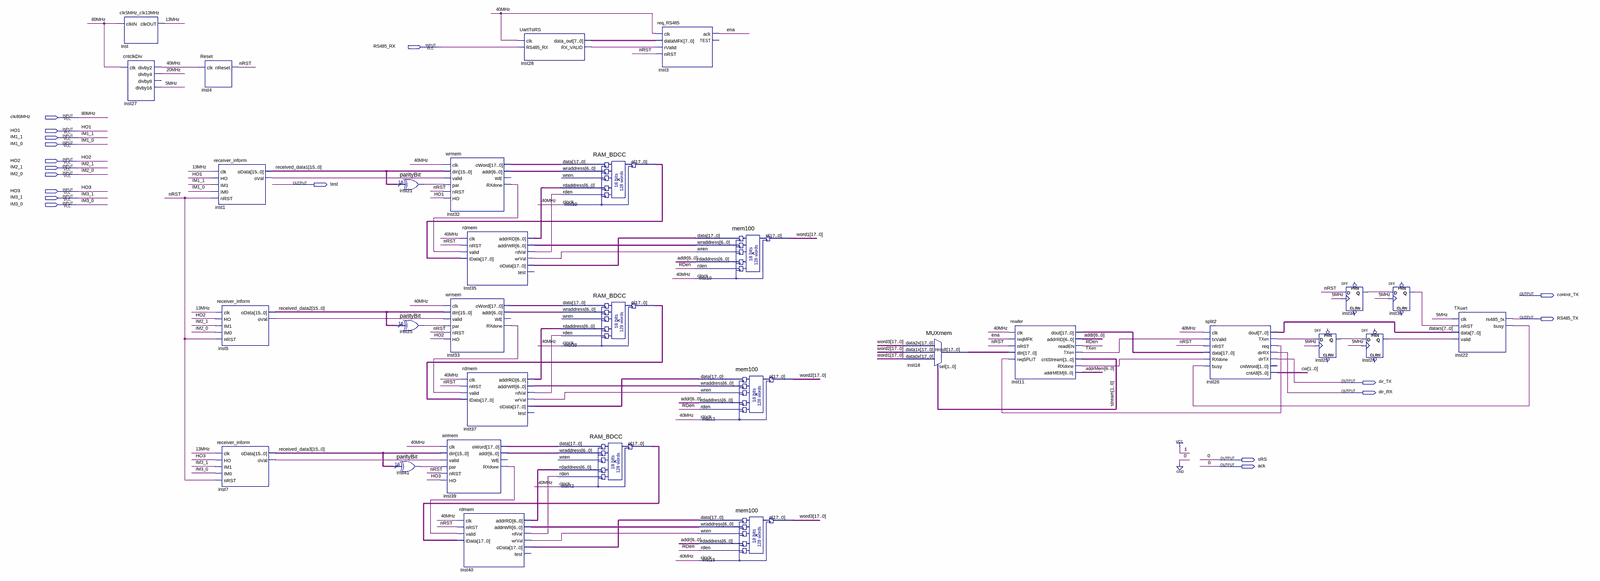
[diagram p0: schematic sheet, whole]
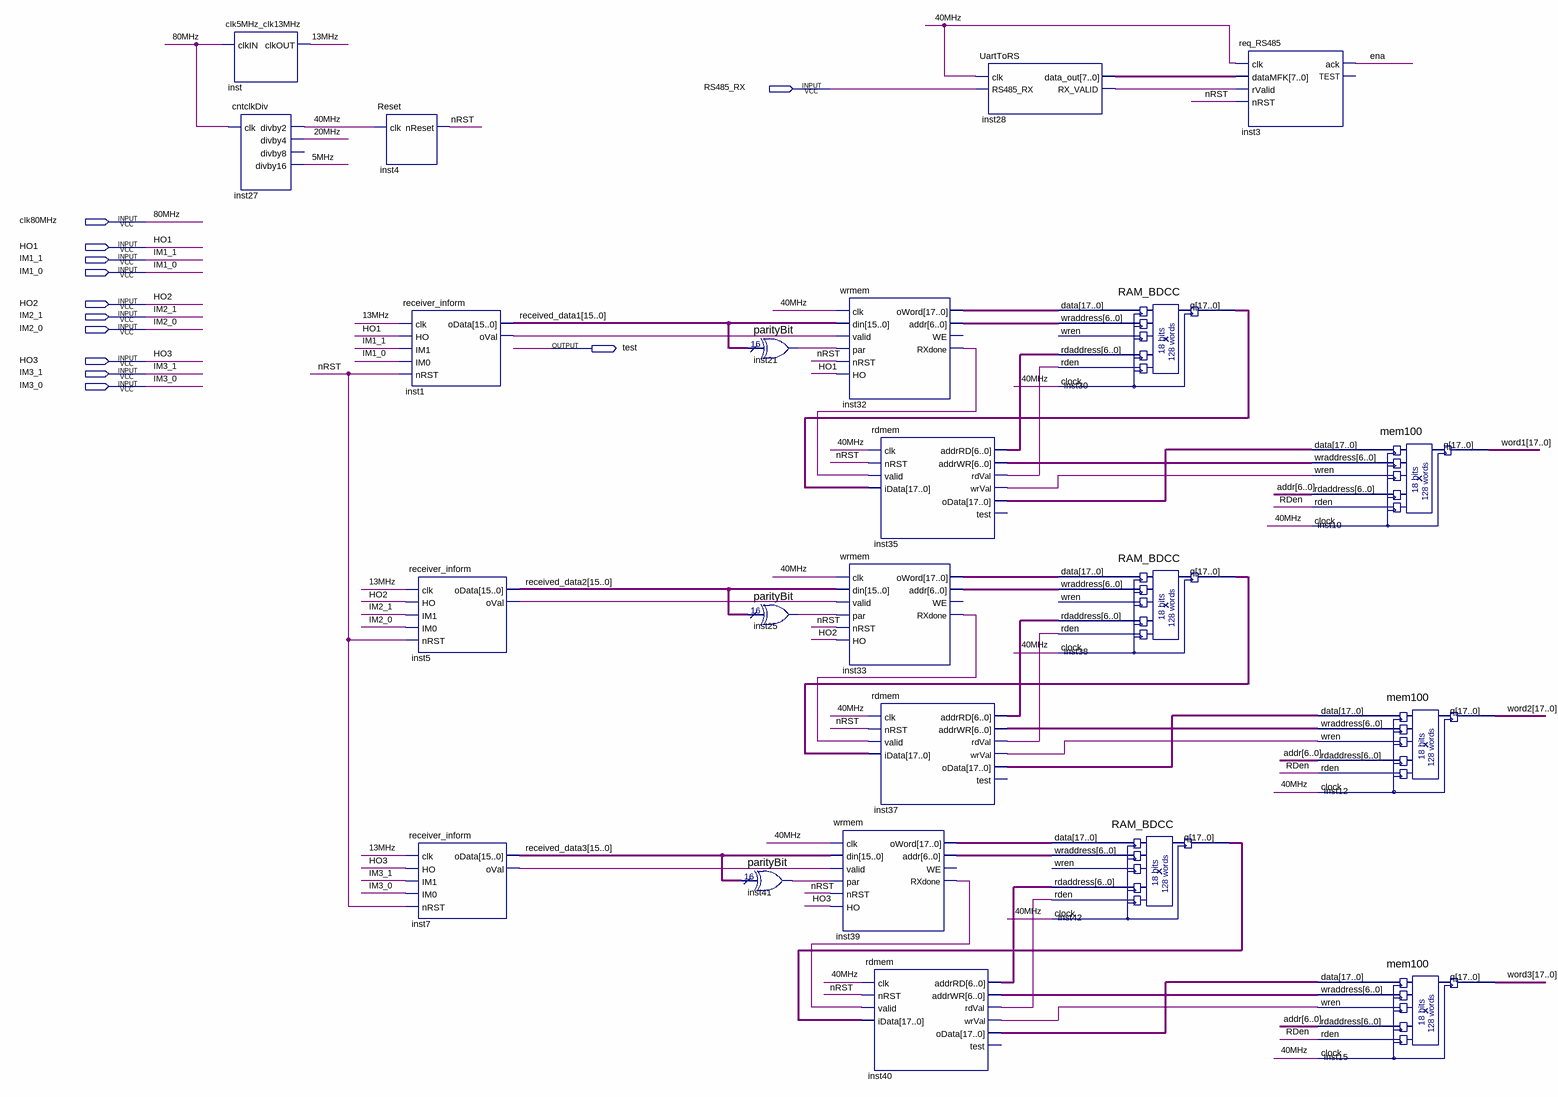
[diagram p1: schematic sheet, left part]
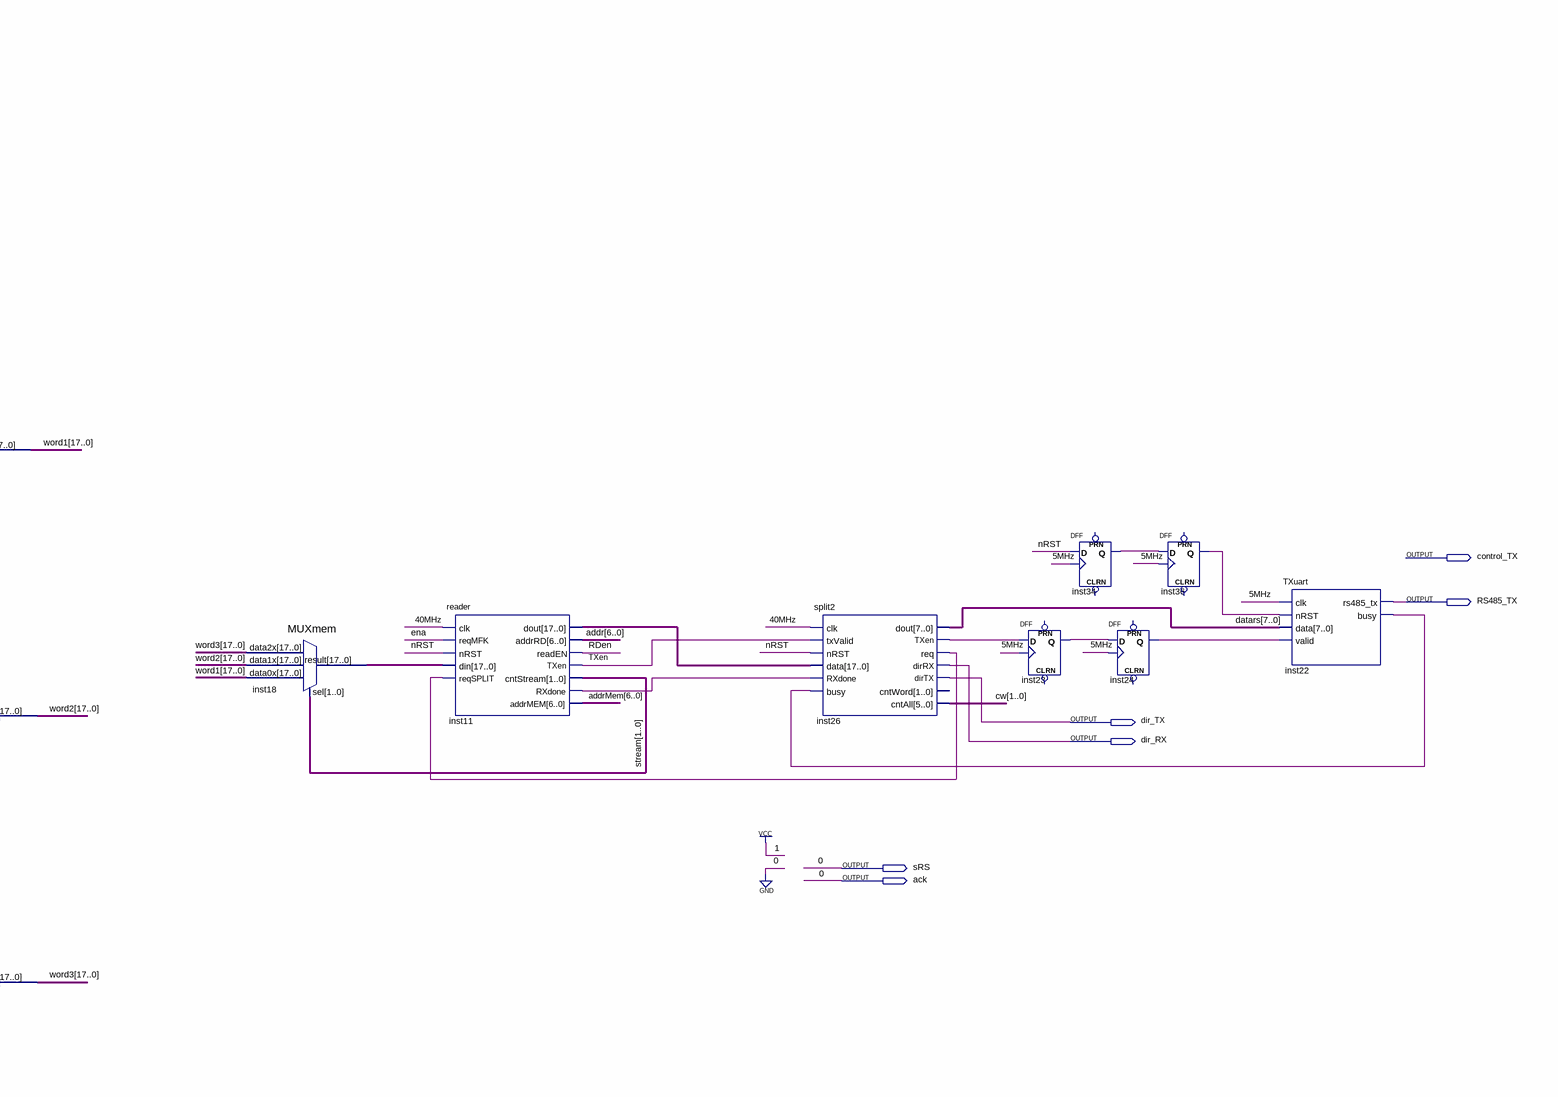
[diagram p2: schematic sheet, right part]
// Quartus schematic BCD_rus.bdf as structural Verilog: 31 symbols, 18 pins
module BCD_rus (
  input  RS485_RX,
  input  clk80MHz,
  input  HO1,
  input  IM1_1,
  input  IM1_0,
  input  HO2,
  input  IM2_1,
  input  IM2_0,
  input  HO3,
  input  IM3_1,
  input  IM3_0,
  output test,
  output control_TX,
  output RS485_TX,
  output dir_TX,
  output dir_RX,
  output sRS,
  output ack
);

  wire \5MHz , \13MHz , \20MHz , \40MHz , ena, inst1_oval, inst5_oval, inst7_oval, inst11_rxdone,
       inst21_result, inst22_busy, inst23_q, inst24_q, inst25_result, inst26_req, inst26_txen,
       inst28_rx_valid, inst32_rxdone, inst33_rxdone, inst34_q, inst35_rdval, inst35_wrval, inst36_q,
       inst37_rdval, inst37_wrval, inst39_rxdone, inst40_rdval, inst40_wrval, inst41_result, nRST, RDen, TXen;
  wire [1:0] cw, stream;
  wire [6:0] addr, addrMem, inst32_addr, inst33_addr, inst35_addrrd, inst35_addrwr, inst37_addrrd,
       inst37_addrwr, inst39_addr, inst40_addrrd, inst40_addrwr;
  wire [7:0] datars, inst28_data_out;
  wire [15:0] received_data1, received_data2, received_data3;
  wire [17:0] inst11_dout, inst18_result, inst30_q, inst32_oword, inst33_oword, inst35_odata, inst37_odata,
       inst38_q, inst39_oword, inst40_odata, inst42_q, word1, word2, word3;

  clk5MHz_clk13MHz inst (.clkIN(clk80MHz), .clkOUT(\13MHz ));
  cntclkDiv inst27 (.clk(clk80MHz), .divby2(\40MHz ), .divby4(\20MHz ), .divby16(\5MHz ));  // open: divby8
  Reset inst4 (.clk(\40MHz ), .nReset(nRST));
  receiver_inform inst1 (
    .clk(\13MHz ), .HO(HO1), .IM1(IM1_1), .IM0(IM1_0), .nRST(nRST), .oData(received_data1), .oVal(inst1_oval));
  receiver_inform inst5 (
    .clk(\13MHz ), .HO(HO2), .IM1(IM2_1), .IM0(IM2_0), .nRST(nRST), .oData(received_data2), .oVal(inst5_oval));
  receiver_inform inst7 (
    .clk(\13MHz ), .HO(HO3), .IM1(IM3_1), .IM0(IM3_0), .nRST(nRST), .oData(received_data3), .oVal(inst7_oval));
  parityBit inst21 (.data(received_data1), .result(inst21_result));
  parityBit inst25 (.data(received_data2), .result(inst25_result));
  parityBit inst41 (.data(received_data3), .result(inst41_result));
  wrmem inst39 (
    .clk(\40MHz ), .din(received_data3), .valid(inst7_oval), .par(inst41_result), .nRST(nRST), .HO(HO3),
    .oWord(inst39_oword), .addr(inst39_addr), .RXdone(inst39_rxdone));  // open: WE
  wrmem inst32 (
    .clk(\40MHz ), .din(received_data1), .valid(inst1_oval), .par(inst21_result), .nRST(nRST), .HO(HO1),
    .oWord(inst32_oword), .addr(inst32_addr), .RXdone(inst32_rxdone));  // open: WE
  rdmem inst35 (
    .clk(\40MHz ), .nRST(nRST), .valid(inst32_rxdone), .iData(inst30_q), .addrRD(inst35_addrrd),
    .addrWR(inst35_addrwr), .rdVal(inst35_rdval), .wrVal(inst35_wrval), .oData(inst35_odata));  // open: test
  wrmem inst33 (
    .clk(\40MHz ), .din(received_data2), .valid(inst5_oval), .par(inst25_result), .nRST(nRST), .HO(HO2),
    .oWord(inst33_oword), .addr(inst33_addr), .RXdone(inst33_rxdone));  // open: WE
  rdmem inst37 (
    .clk(\40MHz ), .nRST(nRST), .valid(inst33_rxdone), .iData(inst38_q), .addrRD(inst37_addrrd),
    .addrWR(inst37_addrwr), .rdVal(inst37_rdval), .wrVal(inst37_wrval), .oData(inst37_odata));  // open: test
  rdmem inst40 (
    .clk(\40MHz ), .nRST(nRST), .valid(inst39_rxdone), .iData(inst42_q), .addrRD(inst40_addrrd),
    .addrWR(inst40_addrwr), .rdVal(inst40_rdval), .wrVal(inst40_wrval), .oData(inst40_odata));  // open: test
  UartToRS inst28 (.clk(\40MHz ), .RS485_RX(RS485_RX), .data_out(inst28_data_out), .RX_VALID(inst28_rx_valid));
  RAM_BDCC inst30 (
    .data(inst32_oword), .wraddress(inst32_addr), .rdaddress(inst35_addrrd), .rden(inst35_rdval),
    .clock(\40MHz ), .q(inst30_q));  // open: wren
  RAM_BDCC inst38 (
    .data(inst33_oword), .wraddress(inst33_addr), .rdaddress(inst37_addrrd), .rden(inst37_rdval),
    .clock(\40MHz ), .q(inst38_q));  // open: wren
  RAM_BDCC inst42 (
    .data(inst39_oword), .wraddress(inst39_addr), .rdaddress(inst40_addrrd), .rden(inst40_rdval),
    .clock(\40MHz ), .q(inst42_q));  // open: wren
  req_RS485 inst3 (
    .clk(\40MHz ), .dataMFK(inst28_data_out), .rValid(inst28_rx_valid), .nRST(nRST), .ack(ena));  // open: TEST
  mem100 inst10 (
    .data(inst35_odata), .wraddress(inst35_addrwr), .wren(inst35_wrval), .rdaddress(addr), .rden(RDen),
    .clock(\40MHz ), .q(word1));
  mem100 inst12 (
    .data(inst37_odata), .wraddress(inst37_addrwr), .wren(inst37_wrval), .rdaddress(addr), .rden(RDen),
    .clock(\40MHz ), .q(word2));
  mem100 inst15 (
    .data(inst40_odata), .wraddress(inst40_addrwr), .wren(inst40_wrval), .rdaddress(addr), .rden(RDen),
    .clock(\40MHz ), .q(word3));
  MUXmem inst18 (.data2x(word3), .data1x(word2), .data0x(word1), .sel(stream), .result(inst18_result));
  reader inst11 (
    .clk(\40MHz ), .reqMFK(ena), .nRST(nRST), .din(inst18_result), .reqSPLIT(inst26_req), .dout(inst11_dout),
    .addrRD(addr), .readEN(RDen), .TXen(TXen), .cntStream(stream), .RXdone(inst11_rxdone), .addrMEM(addrMem));
  split2 inst26 (
    .clk(\40MHz ), .txValid(TXen), .nRST(nRST), .data(inst11_dout), .RXdone(inst11_rxdone),
    .busy(inst22_busy), .dout(datars), .TXen(inst26_txen), .req(inst26_req), .dirRX(dir_RX), .dirTX(dir_TX),
    .cntAll(cw));  // open: cntWord
  DFF inst23 (.CLK(\5MHz ), .D(inst26_txen), .Q(inst23_q));  // open: CLRN, PRN
  DFF inst34 (.CLK(\5MHz ), .D(nRST), .Q(inst34_q));  // open: CLRN, PRN
  DFF inst24 (.CLK(\5MHz ), .D(inst23_q), .Q(inst24_q));  // open: CLRN, PRN
  DFF inst36 (.CLK(\5MHz ), .D(inst34_q), .Q(inst36_q));  // open: CLRN, PRN
  TXuart inst22 (
    .clk(\5MHz ), .nRST(inst36_q), .data(datars), .valid(inst24_q), .rs485_tx(RS485_TX), .busy(inst22_busy));

  assign ack = 1'b0;
  assign sRS = 1'b0;

  // Other names for the same wires on the sheet: 80MHz = clk80MHz
endmodule
